# EAGLE design indicator (EAGLE 7.3.0)
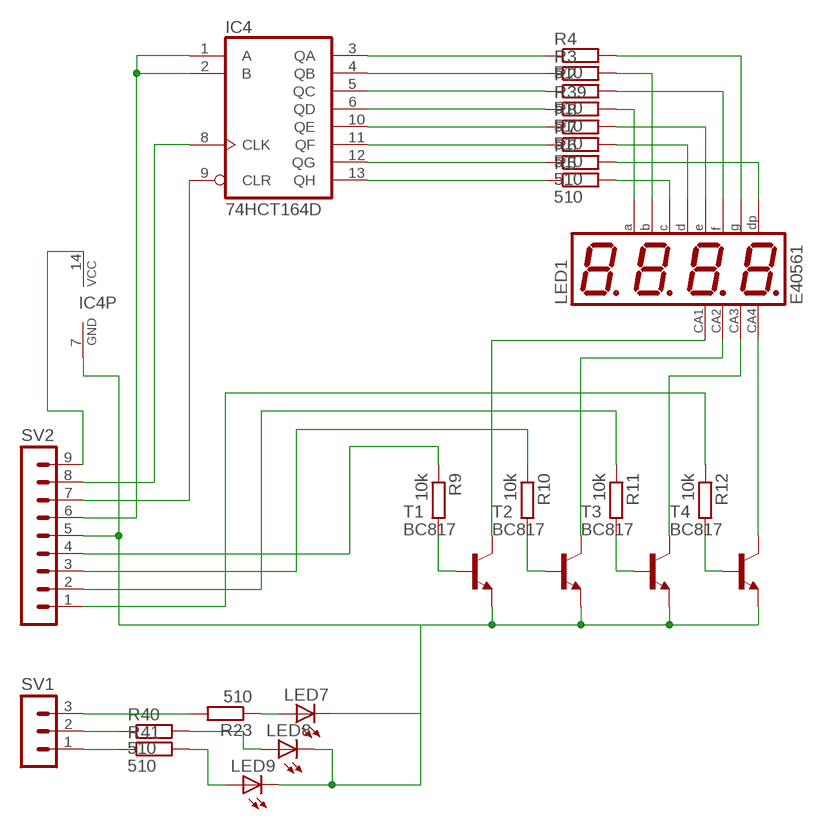
[diagram p0: schematic, sheet 1]

## Parts
IC4  74HCT164D  [SO14]
LED1  E40561  BA56-12EWA  [BX56-12]
LED7  LED5MM  [LED5MM]
LED8  LED5MM  [LED5MM]
LED9  LED5MM  [LED5MM]
R2  510  R-EU_R0805  [R0805]
R3  R-EU_R0805  [R0805]
R4  510  R-EU_R0805  [R0805]
R5  510  R-EU_R0805  [R0805]
R6  510  R-EU_R0805  [R0805]
R7  510  R-EU_R0805  [R0805]
R8  510  R-EU_R0805  [R0805]
R9  10k  R-EU_R0805  [R0805]
R10  10k  R-EU_R0805  [R0805]
R11  10k  R-EU_R0805  [R0805]
R12  10k  R-EU_R0805  [R0805]
R23  510  R-EU_R0805  [R0805]
R39  510  R-EU_R0805  [R0805]
R40  510  R-EU_R0805  [R0805]
R41  510  R-EU_R0805  [R0805]
SV1  MA03-1  [MA03-1]
SV2  MA09-1  [MA09-1]
T1  BC817  BC817-16-NPN-SOT23-BEC  [SOT23-BEC]
T2  BC817  BC817-16-NPN-SOT23-BEC  [SOT23-BEC]
T3  BC817  BC817-16-NPN-SOT23-BEC  [SOT23-BEC]
T4  BC817  BC817-16-NPN-SOT23-BEC  [SOT23-BEC]

## Nets
N$1: R9.2 T1.B
N$2: R10.2 T2.B
N$3: R11.2 T3.B
N$4: R12.2 T4.B
N$5: LED1.6(CA) T4.C
N$6: LED1.8(CA) T3.C
N$7: LED1.9(CA) T2.C
N$8: LED1.12(CA) T1.C
N$9: R40.1 SV1.2
N$10: LED1.1(E) R8.2
N$11: IC4.6(QD) R39.1
N$12: IC4.5(QC) R2.1
N$13: IC4.4(QB) R3.1
N$14: IC4.3(QA) R4.1
N$15: IC4.10(QE) R8.1
N$16: IC4.11(QF) R7.1
N$17: LED1.2(D) R7.2
N$18: LED1.3(DP) R6.2
N$19: LED1.4(C) R5.2
N$20: LED1.5(G) R4.2
N$21: LED1.7(B) R3.2
N$22: LED1.10(F) R2.2
N$23: LED1.11(A) R39.2
N$24: R41.1 SV1.1
N$26: IC4.12(QG) R6.1
N$27: R12.1 SV2.1
N$28: IC4.13(QH) R5.1
N$29: IC4.8(CLK) SV2.8
N$30: IC4.9(CLR) SV2.7
N$32: IC4.7(GND) LED7.K(C) LED8.K(C) LED9.K(C) SV2.5 T1.E T2.E T3.E T4.E
N$53: LED7.A R23.1
N$54: IC4.1(A) IC4.2(B) SV2.6
N$65: LED8.A R40.2
N$66: LED9.A R41.2
N$70: R10.1 SV2.3
N$72: R9.1 SV2.4
N$74: R11.1 SV2.2
N$75: IC4.14(VCC) SV2.9
N$85: R23.2 SV1.3

## Library data of the parts
IC4 = 74xx-eu:74*164: 8-bit parallel out SHIFT REGISTER
LED1 = winder:B?56-12*WA: 14.22mm (0.56INCH) THREE DIGIT NUMERIC DISPLAY Source: http://www.kingbright.com .. BA56-11EWA(Ver1189474895.pdf; OC_FARNELL: unknown; OC_NEWARK: unknown
LED7-LED9 = led:LED: LED OSRAM: - CHIPLED LG R971, LG N971, LY N971, LG Q971, LY Q971, LO R971, LY R971 LH N974, LH R974 LS Q976, LO Q976, LY Q976 LO Q996 - Hyper CHIPLED LW Q18S LB Q993, LB Q99A, LB R99A - SideLED LS A670, LO A670, LY A670, LG A670, LP A670 LB A673, LV A673, LT A673, LW A673 LH A674 LY A675 LS A676, LA A676, LO A676, LY A676, LW A676 LS A679, LY A679, LG A679 - Hyper Micro SIDELED® LS Y876, LA Y876, LO Y876, LY Y876 LT Y87S - SmartLED LW L88C, LW L88S LB L89C, LB L89S, LG L890 LS L89K, LO L89K, LY L89K LS L896, LA L896, LO L896, LY L896 - TOPLED LS T670, LO T670, LY T670, LG T670, LP T670 LSG T670, LSP T670, LSY T670, LOP T670, LYG T670 LG T671, LOG T671, LSG T671 LB T673, LV T673, LT T673, LW T673 LH T674 LS T676, LA T676, LO T676, LY T676, LB T676, LH T676, LSB T676, LW T676 LB T67C, LV T67C, LT T67C, LS T67K, LO T67K, LY T67K, LW E67C LS E67B, LA E67B, LO E67B, LY E67B, LB E67C, LV E67C, LT E67C LW T67C LS T679, LY T679, LG T679 LS T770, LO T770, LY T770, LG T770, LP T770 LB T773, LV T773, LT T773, LW T773 LH T774 LS E675, LA E675, LY E675, LS T675 LS T776, LA T776, LO T776, LY T776, LB T776 LHGB T686 LT T68C, LB T68C - Hyper Mini TOPLED® LB M676 - Mini TOPLED Santana® LG M470 LS M47K, LO M47K, LY M47K Source: http://www.osram.convergy.de LUXEON: - LUMILED® LXK2-PW12-R00, LXK2-PW12-S00, LXK2-PW14-U00, LXK2-PW14-V00 LXK2-PM12-R00, LXK2-PM12-S00, LXK2-PM14-U00 LXK2-PE12-Q00, LXK2-PE12-R00, LXK2-PE12-S00, LXK2-PE14-T00, LXK2-PE14-U00 LXK2-PB12-K00, LXK2-PB12-L00, LXK2-PB12-M00, LXK2-PB14-N00, LXK2-PB14-P00, LXK2-PB14-Q00 LXK2-PR12-L00, LXK2-PR12-M00, LXK2-PR14-Q00, LXK2-PR14-R00 LXK2-PD12-Q00, LXK2-PD12-R00, LXK2-PD12-S00 LXK2-PH12-R00, LXK2-PH12-S00 LXK2-PL12-P00, LXK2-PL12-Q00, LXK2-PL12-R00 Source: www.luxeon.com KINGBRIGHT: KA-3528ASYC Source: www.kingbright.com
R2-R12 R23 R39-R41 = rcl:R-EU_: RESISTOR, European symbol
SV1 = con-lstb:MA03-1: PIN HEADER; OC_FARNELL: unknown; OC_NEWARK: unknown
SV2 = con-lstb:MA09-1: PIN HEADER; OC_FARNELL: unknown; OC_NEWARK: unknown
T1-T4 = transistor:*-NPN-: NPN Transistror BF959 corrected 2008.03.06

## Board
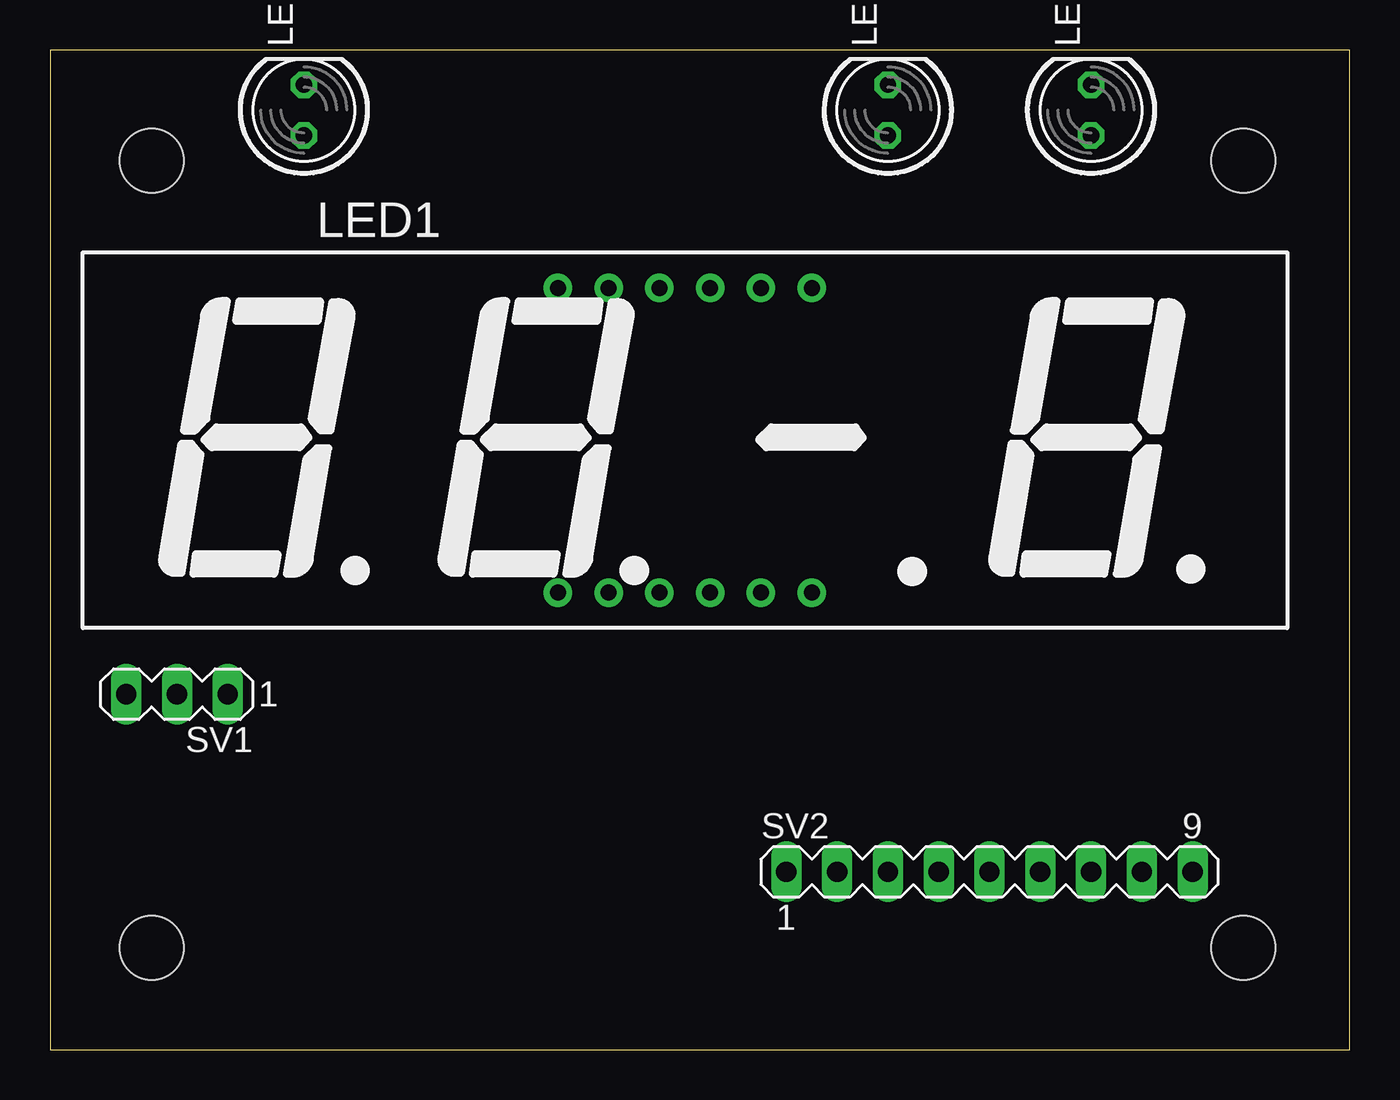
[diagram p1: board, top side]
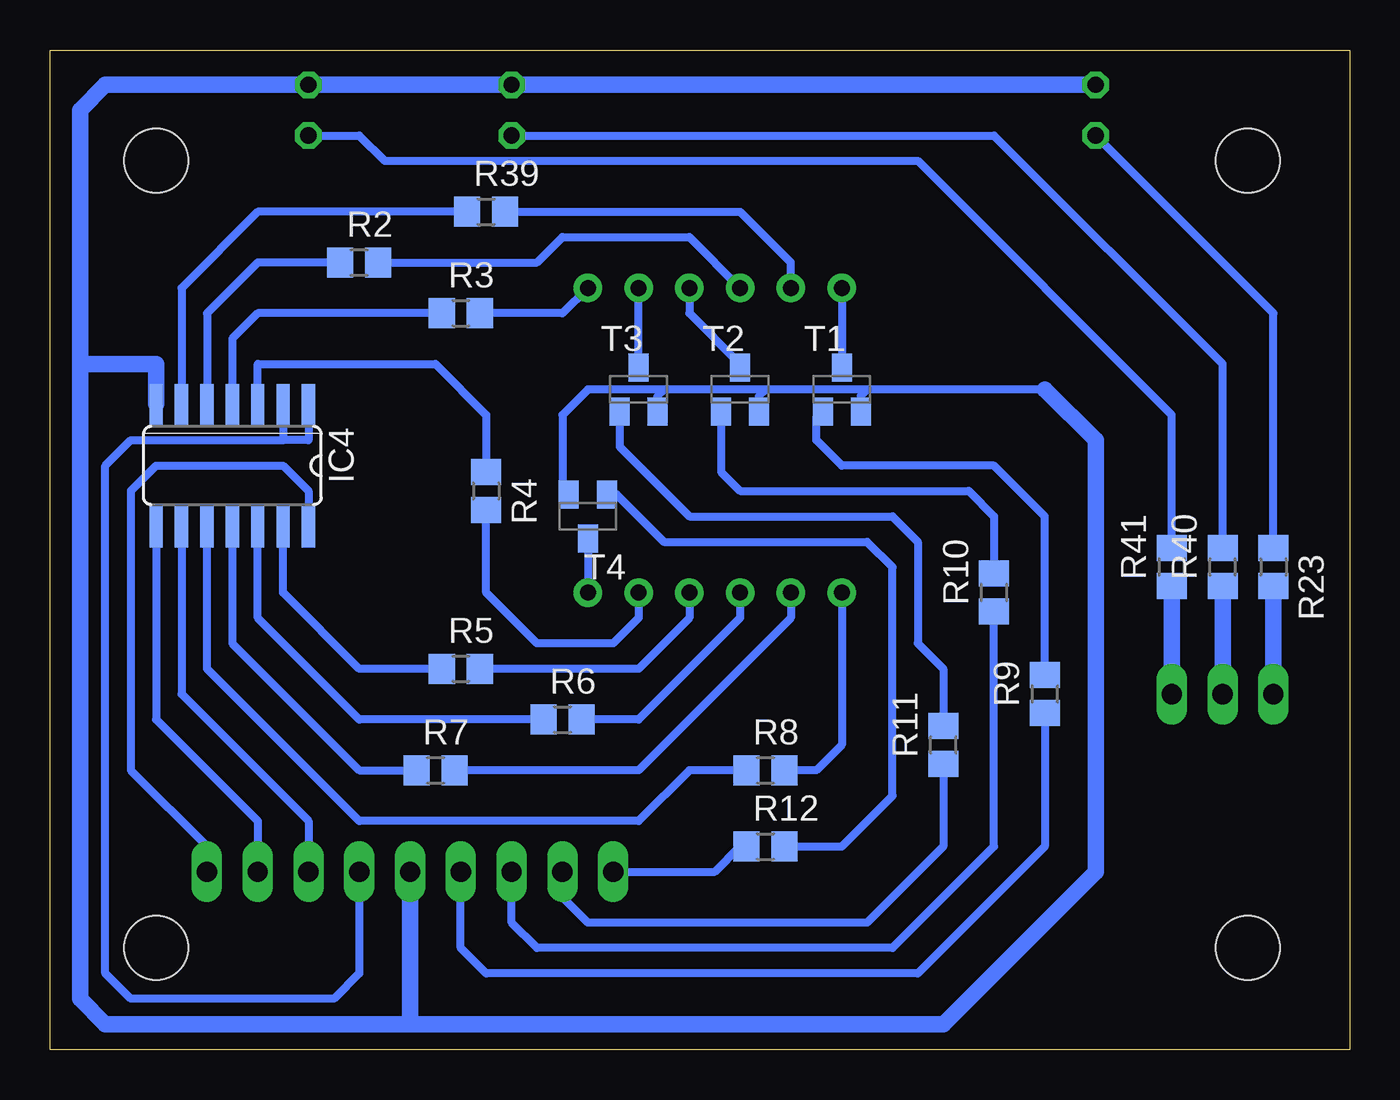
[diagram p2: board, bottom side, seen from below]

Size 65 x 50 mm. Coordinates in mm from the lower left corner, seen from the top.
Outline: 0,0 65,0 65,50 0,50 0,0
Copper layers (1*16): Top 0.035mm / dielectric 1.5mm / Bottom 0.035mm
Design rules "default": minimum track width 10mil, minimum drill 24mil, track to track 8mil, track to pad 8mil, pad to pad 8mil, via to via 8mil, smd to smd 8mil, copper to edge 40mil, drill to drill 8mil, minimum pad ring 10mil, minimum via ring 8mil, stop-mask expansion 4mil, vias tented up to drill 0mil, thermal gap 10mil
Holes 3.2 mm at 59.69,44.45 5.08,44.45 5.08,5.08 59.69,5.08

### Footprints (pad centres in the part's own frame; a part is rotated, then mirrored left to right if it is on the bottom)
SO14 = smd 0.66 x 2.032: 1 -3.81,-3.073; 2 -2.54,-3.073; 3 -1.27,-3.073; 4 0,-3.073; 5 1.27,-3.073; 6 2.54,-3.073; 7 3.81,-3.073; 8 3.81,3.073; 9 2.54,3.073; 10 1.27,3.073; 11 0,3.073; 12 -1.27,3.073; 13 -2.54,3.073; 14 -3.81,3.073
BX56-12 = drill 0.8 pad 1.422: 1 -6.35,-7.62; 2 -3.81,-7.62; 3 -1.27,-7.62; 4 1.27,-7.62; 5 3.81,-7.62; 6 6.35,-7.62; 7 6.35,7.62; 8 3.81,7.62; 9 1.27,7.62; 10 -1.27,7.62; 11 -3.81,7.62; 12 -6.35,7.62
LED5MM = drill 0.813 octagon: A -1.27,0; K 1.27,0
R0805 = smd 1.3 x 1.5: 1 -0.95,0; 2 0.95,0
MA03-1 = drill 1.016 long: 1 -2.54,0; 2 0,0; 3 2.54,0
MA09-1 = drill 1.016 long: 1 -10.16,0; 2 -7.62,0; 3 -5.08,0; 4 -2.54,0; 5 0,0; 6 2.54,0; 7 5.08,0; 8 7.62,0; 9 10.16,0
SOT23-BEC = smd 1 x 1.4: B -0.95,-1.1; C 0,1.1; E 0.95,-1.1

### Placement (x,y rotation side)
IC4  55.88,29.21 180 bottom
LED1  31.75,30.48 0 top
LED7  12.7,46.99 90 top
LED8  41.91,46.99 90 top
LED9  52.07,46.99 90 top
R2  49.53,39.37 0 bottom
R3  44.45,36.83 0 bottom
R4  43.18,27.94 270 bottom
R5  44.45,19.05 0 bottom
R6  39.37,16.51 0 bottom
R7  45.72,13.97 0 bottom
R8  29.21,13.97 0 bottom
R9  15.24,17.78 90 bottom
R10  17.78,22.86 90 bottom
R11  20.32,15.24 90 bottom
R12  29.21,10.16 0 bottom
R23  3.81,24.13 270 bottom
R39  43.18,41.91 0 bottom
R40  6.35,24.13 90 bottom
R41  8.89,24.13 90 bottom
SV1  6.35,17.78 180 top
SV2  46.99,8.89 0 top
T1  25.4,33.02 0 bottom
T2  30.48,33.02 0 bottom
T3  35.56,33.02 0 bottom
T4  38.1,26.67 180 bottom

### Tracks (layer width: path | path; a pad name or v marks a point on that pad's centre or on a via)
N$1
  Bottom 0.406: R9.2 15.24,26.67 17.78,29.21 25.4,29.21 26.67,30.48 26.67,31.6 T1.B
N$2
  Bottom 0.406: T2.B 31.43,28.89 30.48,27.94 19.05,27.94 17.78,26.67 R10.2
N$3
  Bottom 0.406: T3.B 36.51,30.16 33.02,26.67 22.86,26.67 21.59,25.4 21.59,20.32 20.32,19.05 R11.2
N$4
  Bottom 0.406: T4.B 36.66,27.77 34.29,25.4 24.13,25.4 22.86,24.13 22.86,12.7 25.4,10.16 R12.2
N$5
  Bottom 0.406: T4.C LED1.6
N$6
  Bottom 0.406: T3.C LED1.8
N$7
  Bottom 0.406: LED1.9 33.02,36.83 30.48,34.29 T2.C
N$8
  Bottom 0.406: LED1.12 T1.C
N$9
  Bottom 0.813: R40.1 SV1.2
N$10
  Bottom 0.406: LED1.1 25.4,15.24 26.67,13.97 R8.2
N$11
  Bottom 0.406: R39.1 54.61,41.91 58.42,38.1 IC4.6
N$12
  Bottom 0.406: R2.1 54.61,39.37 57.15,36.83 IC4.5
N$13
  Bottom 0.406: R3.1 54.61,36.83 55.88,35.56 IC4.4
N$14
  Bottom 0.406: IC4.3 54.61,34.29 45.72,34.29 43.18,31.75 R4.1
N$15
  Bottom 0.406: R8.1 33.02,13.97 35.56,11.43 49.53,11.43 57.15,19.05 IC4.10
N$16
  Bottom 0.406: IC4.11 55.88,20.32 49.53,13.97 R7.1
N$17
  Bottom 0.406: LED1.2 27.94,21.59 35.56,13.97 R7.2
N$18
  Bottom 0.406: LED1.3 30.48,21.59 35.56,16.51 R6.2
N$19
  Bottom 0.406: LED1.4 33.02,21.59 35.56,19.05 R5.2
N$20
  Bottom 0.406: LED1.5 35.56,21.59 36.83,20.32 40.64,20.32 43.18,22.86 R4.2
N$21
  Bottom 0.406: LED1.7 39.37,36.83 R3.2
N$22
  Bottom 0.406: LED1.10 33.02,40.64 39.37,40.64 40.64,39.37 R2.2
N$23
  Bottom 0.406: LED1.11 27.94,39.37 30.48,41.91 R39.2
N$24
  Bottom 0.813: R41.1 SV1.1
N$26
  Bottom 0.406: R6.1 49.53,16.51 54.61,21.59 IC4.12
N$27
  Bottom 0.406: R12.1 30.48,10.16 31.75,8.89 SV2.1
N$28
  Bottom 0.406: R5.1 49.53,19.05 53.34,22.86 IC4.13
N$29
  Bottom 0.406: IC4.8 59.69,16.51 54.61,11.43 SV2.8
N$30
  Bottom 0.406: IC4.9 58.42,17.78 52.07,11.43 SV2.7
N$32
  Bottom 0.406: 15.24,33.02 24.13,33.02 | 24.13,33.02 29.21,33.02 | 29.21,33.02 34.29,33.02 | 34.29,33.02 38.1,33.02 39.37,31.75 39.37,28.09 T4.E | T1.E 24.45,32.7 24.13,33.02 | T2.E 29.53,32.7 29.21,33.02 | T3.E 34.61,32.7 34.29,33.02
  Bottom 0.813: LED7.K LED8.K LED9.K 62.23,48.26 63.5,46.99 63.5,34.29 | IC4.7 59.69,34.29 63.5,34.29 | SV2.5 46.99,1.27 | 46.99,1.27 20.32,1.27 12.7,8.89 12.7,30.48 15.24,33.02 | 46.99,1.27 62.23,1.27 63.5,2.54 63.5,34.29
N$53
  Bottom 0.406: R23.1 3.81,36.83 LED7.A
N$54
  Bottom 0.406: IC4.1 52.07,30.48 53.34,30.48 | IC4.2 53.34,30.48 | 53.34,30.48 60.96,30.48 62.23,29.21 62.23,3.81 60.96,2.54 50.8,2.54 49.53,3.81 SV2.6
N$65
  Bottom 0.406: LED8.A 17.78,45.72 6.35,34.29 R40.2
N$66
  Bottom 0.406: LED9.A 49.53,45.72 48.26,44.45 21.59,44.45 8.89,31.75 R41.2
N$70
  Bottom 0.406: R10.1 17.78,10.16 22.86,5.08 40.64,5.08 41.91,6.35 SV2.3
N$72
  Bottom 0.406: R9.1 15.24,10.16 21.59,3.81 43.18,3.81 44.45,5.08 SV2.4
N$74
  Bottom 0.406: R11.1 20.32,10.16 24.13,6.35 38.1,6.35 39.37,7.62 SV2.2
N$75
  Bottom 0.406: SV2.9 57.15,10.16 60.96,13.97 60.96,27.94 59.69,29.21 53.34,29.21 52.07,27.94 IC4.14
N$85
  Bottom 0.813: R23.2 SV1.3